# Altium schematic sheet Interface.SchDoc
size A3; Author: Ali Zoubir; Organization: ETML-ES; Address1: Avenue Recordon 1; Address2: 1004 Lausanne; Address3: Switzerland; Revision: 2221; SheetNumber: 4; SheetTotal: 6; Version: V0
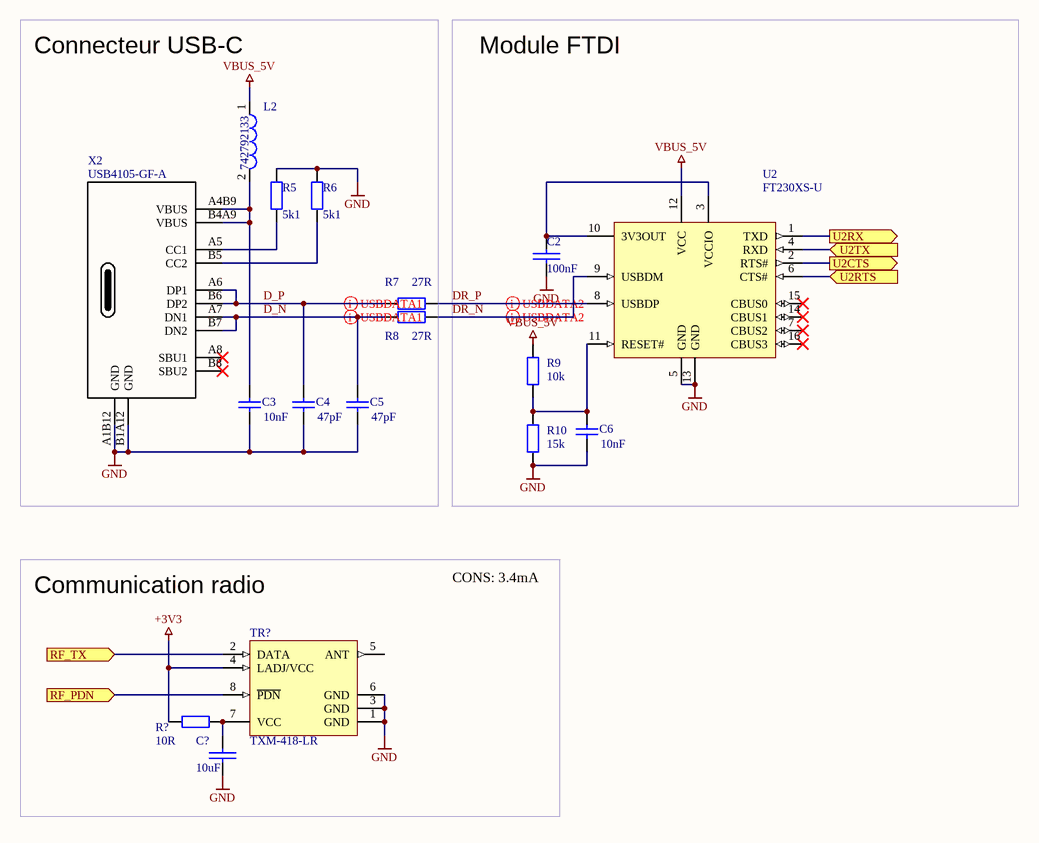
[diagram p0: Interface.SchDoc]

## Parts
C2  100nF  [6-0805_L]
C3  10nF  [6-0805_L]
C4  47pF  [6-0805_L]
C5  47pF  [6-0805_L]
C6  10nF  [6-0805_L]
C?  10uF  [6-0805_L]
L2  742792133  [SMD-1206]
R5  5k1  [6-0805_L]
R6  5k1  [6-0805_L]
R7  27R  [6-0805_L]
R8  27R  [6-0805_L]
R9  10k  [6-0805_L]
R10  15k  [6-0805_L]
R?  value 10R  [6-0805_L]  (hidden comment: 27R)
TR?  TXM-418-LR  [LMD0.36-8-S]
U2  FT230XS-U  [SSOP-16_N]
X2  USB4105-GF-A  [GCT_USB4105-GF-A]

## Blocks framed on the sheet
Connecteur USB-C: C3-C5 L2 R5-R8 X2
Module FTDI: C2 C6 R9 R10 U2
Communication radio: C? R? TR?

## Ports
RF_PDN (in), RF_TX (in), U2CTS (out), U2RTS (in), U2RX (out), U2TX (in)

## Nets
+3V3: R?.1 TR?.4(LADJ/VCC)
GND: C2.2 C3.1 C4.1 C5.1 C6.1 C?.2 R5.2 R6.2 R10.1 TR?.1(GND) TR?.3(GND) TR?.6(GND) U2.5(GND) U2.13(GND) X2.A1B12(GND) X2.B1A12(GND)
VBUS_5V: L2.1 R9.2 U2.12(VCC)
D_N: C5.2 R8.1 X2.A7(DN1) X2.B7(DN2)
D_P: C4.2 R7.1 X2.A6(DP1) X2.B6(DP2)
DR_N: R8.2 U2.9(USBDM)
DR_P: R7.2 U2.8(USBDP)
RF_PDN: TR?.8(~{PDN}) ; port RF_PDN
RF_TX: TR?.2(DATA) ; port RF_TX
U2CTS: U2.2(RTS#) ; port U2CTS
U2RTS: U2.6(CTS#) ; port U2RTS
U2RX: U2.1(TXD) ; port U2RX
U2TX: U2.4(RXD) ; port U2TX
NetC2_1: C2.1 U2.3(VCCIO) U2.10(3V3OUT)
NetC3_2: C3.2 L2.2 X2.A4B9(VBUS) X2.B4A9(VBUS)
NetC6_2: C6.2 R9.1 R10.2 U2.11(RESET#)
NetC?_1: C?.1 R?.2 TR?.7(VCC)
NetR5_1: R5.1 X2.A5(CC1)
NetR6_1: R6.1 X2.B5(CC2)

Not connected (* = marked no-connect by the designer): TR? 5(ANT); U2 7(CBUS2)* 14(CBUS1)* 15(CBUS0)* 16(CBUS3)*; X2 A8(SBU1)* B8(SBU2)*

## Layout directives
differential pair: D_N, D_P, DR_N, DR_P

## Notes on the sheet
- CONS: 3.4mA
- Fichier :
- a
- Date :
- Heure :
- Version :
- Auteur :
- Modif.
- b
- c
- d
- Projet :
- No :
- Nb feuilles
- Feuille n°
- Chemin :

## Library data of the parts
C2 C? = C: SDTSourceLibName: C:\WINDOWS\TEMP\DA.LIB; PCB Footprint: RC0805
C3-C6 = Cap: Capacitor; Published: 8-Jun-2000; LatestRevisionDate: 17-Jul-2002; LatestRevisionNote: Re-released for DXP Platform.; PackageReference: RAD-0.3; Publisher: Altium Limited; PackageDescription: Radial Cap, Thru-Hole; 2 Leads; 0.3 in Pin Spacing
  C3 C6: Value: 10nF
  C4 C5: Value: 47pF
L2 = CMP-0220-00010-1: SMD EMI Suppression Ferrite Bead WE-CBF, Z = 600 Ohm; Impedance: 600 Ohm; ComponentLink1Description: Manufacturer Link; DatasheetVersion: ver 2, Aug-2007; ComponentLink1URL: http://www.we-online.com; PackageDescription: Chip Inductor, 2-Leads, Body 3.2 x 1.6 mm; ComponentLink2URL: http://www.we-online.de/katalog/media/pdf/742792133.pdf; PackageVersion: 2007; PackageReference: SMD-1206; ComponentLink2Description: Datasheet
R5-R10 R? = Res2: Res 0805; Published: 8-Jun-2000; LatestRevisionDate: 17-Jul-2002; LatestRevisionNote: Re-released for DXP Platform.; PackageReference: AXIAL-0.4; Publisher: Altium Limited; PackageDescription: Axial Device, Thru-Hole; 2 Leads; 0.4 in Pin Spacing
  R5 R6: Value: 5k1
  R7 R8: Value: 27R
  R9: Value: 10k
  R10: Value: 15k
TR? = CMP-0171-00005-1: Low Cost RF Transmitter Module, LR Series, 418MHz, SMD; PCB_Layout: Pads complies with manufacturer's recommendation.; DatasheetVersion: Mar-2010; PackageVersion: Mar-2010; PackageDescription: RF Module, LR Series, SM, 8-Lead, 12.7 x 9.15 x 3.3 mm Body; PackageReference: LMD0.36-8-S
U2 = CMP-0248-00025-2: USB to Basic UART Interface Chip, UHCI/OHCI/EHCI Compatible, USB 2.0 Compatible, -40 to +85 degC, 16-Pin SSOP, Pb-Free, Tube; Manufacturer: FTDI; PackageDescription: 16-Pin Small Outline Package, 8.6 x 3.9 mm Body, 0.635 mm Pitch; ComponentLink2URL: http://www.ftdichip.com/Support/Documents/DataSheets/ICs/DS_FT230X.pdf; ComponentLink3URL: www.ftdichip.com/Products/ICs/FT230X.html; PartNumber: FT230XS-U; RevisionNote: DatasheetVersion updated to 1.2 Feb-2013; PackageVersion: Feb-13; ComponentLink2Description: Datasheet; Code_JEDEC: MO-137-AB; DatasheetVersion: ver 1.2, Feb-2013; ComponentLink1URL: http://www.ftdichip.com/; PackageReference: SSOP-16; ComponentLink1Description: Manufacturer URL; ComponentLink3Description: FT230X Product Page
X2 = USB-C Type 2.0: USB4105-GF-A USB connector; ComponentLink1Description: LCSC  C319148; ComponentLink1URL: https://lcsc.com/product-detail/USB-Connectors_XKB-Connectivity-U262-161N-4BVC11_C319148.html; Supplier 1: LCSC; Supplier Part Number 1: C319148